# EAGLE design programm-adapter (EAGLE 6.1)
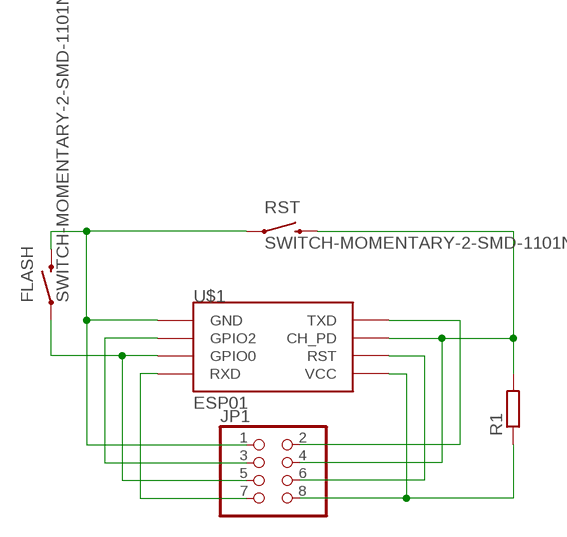
[diagram p0: schematic, sheet 1]

## Parts
FLASH  SWITCH-MOMENTARY-2-SMD-1101NE  [TACTILE-SWITCH-1101NE]
JP1  PINHD-2X4  [2X04]
R1  R-EU_M0805  [M0805]
RST  SWITCH-MOMENTARY-2-SMD-1101NE  [TACTILE-SWITCH-1101NE]
U$1  ESP01  [ESP01]

## Nets
GND: FLASH.2 JP1.1 RST.1 U$1.GND
N$1: JP1.6 U$1.RST
N$3: JP1.4 R1.2 RST.2 U$1.CH_PD
N$4: JP1.2 U$1.TX(TXD)
N$5: JP1.7 U$1.RX(RXD)
N$6: FLASH.1 JP1.5 U$1.GPIO0
N$7: JP1.3 U$1.GPIO2
VCC: JP1.8 R1.1 U$1.VCC

## Library data of the parts
FLASH RST = SparkFun-Electromechanical:SWITCH-MOMENTARY-2: Various NO switches- pushbuttons, reed, etc
JP1 = pinhead:PINHD-2X4: PIN HEADER
R1 = rcl:R-EU_: RESISTOR, European symbol
U$1 = esp8266modules:ESP01: ESP8266 Wifi module 01

## Board
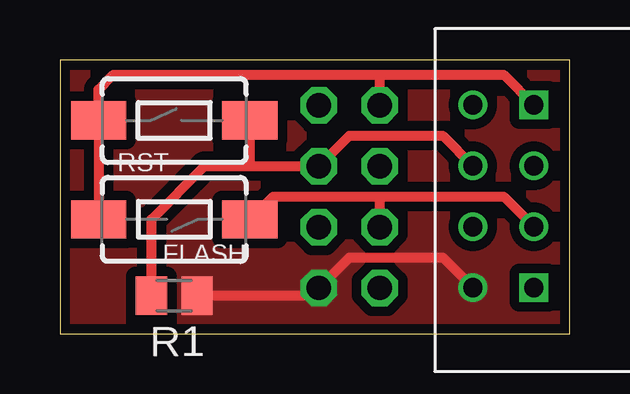
[diagram p1: board, top side]
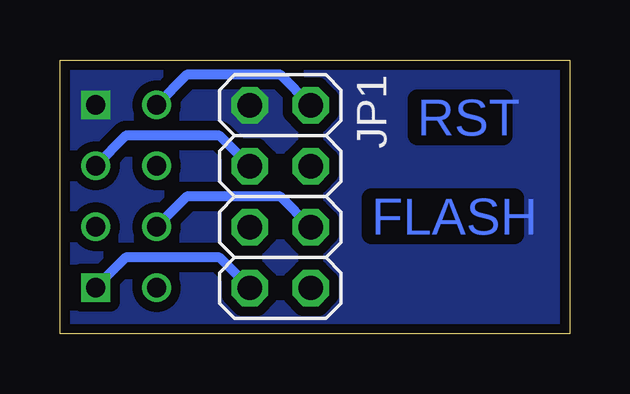
[diagram p2: board, bottom side, seen from below]

Size 21.25 x 11.42 mm. Coordinates in mm from the lower left corner, seen from the top.
Outline: 0,0 21.25,0 21.25,11.42 0,11.42 0,0
Copper layers (1*16): Top 0.0356mm / dielectric 1.5011mm / Bottom 0.0356mm
Design rules: minimum track width 6mil, minimum drill 13mil, track to track 6mil, track to pad 6mil, pad to pad 6mil, via to via 6mil, smd to smd 6mil, copper to edge 15mil, drill to drill 6mil, minimum pad ring 7mil, minimum via ring 7mil, stop-mask expansion 3mil, vias tented up to drill 0mil, thermal gap 10mil

### Footprints (pad centres in the part's own frame; a part is rotated, then mirrored left to right if it is on the bottom)
TACTILE-SWITCH-1101NE = smd 2.3 x 1.6: 1 -3.15,0; 2 3.15,0
2X04 = drill 1.016 octagon: 1 -3.81,-1.27; 2 -3.81,1.27; 3 -1.27,-1.27; 4 -1.27,1.27; 5 1.27,-1.27; 6 1.27,1.27; 7 3.81,-1.27; 8 3.81,1.27
M0805 = smd 1.3 x 1.6: 1 -0.95,0; 2 0.95,0
ESP01 = drill 0.8: CH_PD -1.285,-8.178; GPIO0 1.255,-5.638; GPIO2 -1.285,-5.638; RST 1.255,-8.178; TX -3.825,-8.178; VCC 3.795,-8.178 | drill 0.8 square: GND -3.825,-5.638; RX 3.795,-5.638

### Placement (x,y rotation side)
FLASH  4.76,4.76 180 top
JP1  12.06,5.71 270 bottom
R1  4.76,1.59 180 top
RST  4.76,8.89 0 top
U$1  25.4,5.71 270 top

### Tracks (layer width: path | path; a pad name or v marks a point on that pad's centre or on a via)
GND
  Top 0.406: RST.1 1.61,5.11 1.59,5.08 | RST.1 FLASH.2 | RST.1 1.61,10.19 2.22,10.79 13.34,10.79 | 13.34,10.79 18.51,10.79 U$1.GND | JP1.1 13.34,10.79
  pour Bottom (isolate 0.406, no thermals): 0,11.43 21.27,11.43 21.27,0 0,0
N$1
  Bottom 0.406: JP1.6 12.06,5.71 15.97,5.71 U$1.RST
N$3
  Top 0.406: R1.2 3.81,4.76 6.03,6.99 7.94,6.99 | 7.94,6.99 JP1.4 12.06,8.26 15.97,8.26 U$1.CH_PD | RST.2 7.91,7.01 7.94,6.99
N$4
  Bottom 0.406: JP1.2 12.06,10.79 15.97,10.79 U$1.TX
N$5
  Bottom 0.406: JP1.7 14.61,3.17 18.51,3.17 U$1.RX
N$6
  Top 0.406: FLASH.1 8.26,5.08 8.89,5.71 13.34,5.71 | 13.34,5.71 18.51,5.71 U$1.GPIO0 | JP1.5 13.34,5.71
N$7
  Bottom 0.406: JP1.3 14.61,8.26 18.51,8.26 U$1.GPIO2
VCC
  Top 0.406: U$1.VCC 15.97,3.17 12.06,3.17 JP1.8 10.48,1.59 R1.1
  pour Top (isolate 0.406, no thermals): 0,11.43 21.27,11.43 21.27,0 0,0

### Text on the board
Bottom: RST | FLASH